# Altium project PCB_Project.PrjPcb
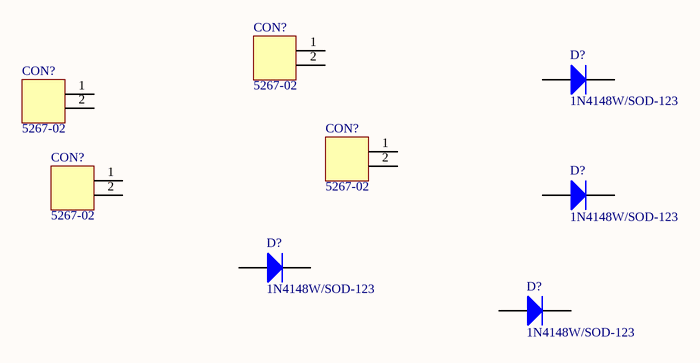
[diagram p0: Tutorial.SchDoc]
1 sheet, 8 parts. Net scope: global (net labels, ports and power ports of the same name join across sheets).
Board file: Tutorial.PcbDoc

## Sheet Tutorial.SchDoc
size A4

### Parts
(Parts that share a designator on the sheet are numbered #1, #2 ... from top to bottom, then left to right.)
CON?#1  5267-02  [CND-5267-02]
CON?#2  5267-02  [CND-5267-02]
CON?#3  5267-02  [CND-5267-02]
CON?#4  5267-02  [CND-5267-02]
D?#1  1N4148W/SOD-123  [DS-SOD-123]
D?#2  1N4148W/SOD-123  [DS-SOD-123]
D?#3  1N4148W/SOD-123  [DS-SOD-123]
D?#4  1N4148W/SOD-123  [DS-SOD-123]

### Nets

Not connected (* = marked no-connect by the designer): CON?#1 1 2; CON?#2 1 2; CON?#3 1 2; CON?#4 1 2; D?#1 1(Anode) 2(Cathode); D?#2 1(Anode) 2(Cathode); D?#3 1(Anode) 2(Cathode); D?#4 1(Anode) 2(Cathode)

### Library data of the parts
CON?#1-CON?#4 = 5267-02: CND-Molex-2.5mm
D?#1-D?#4 = 1N4148W: DS-SDO-123